# EasyEDA Pro project Project.epro

# Schematic Schematic1
Board Name: Board1; Create Date: 2026-02-10; Page Name: P1; Project Name: tp4056 charger; Schematic Name: Schematic1; Update Date: 2026-02-09; Company: EasyEDA.com; Page Size: A4; Version: V1.0
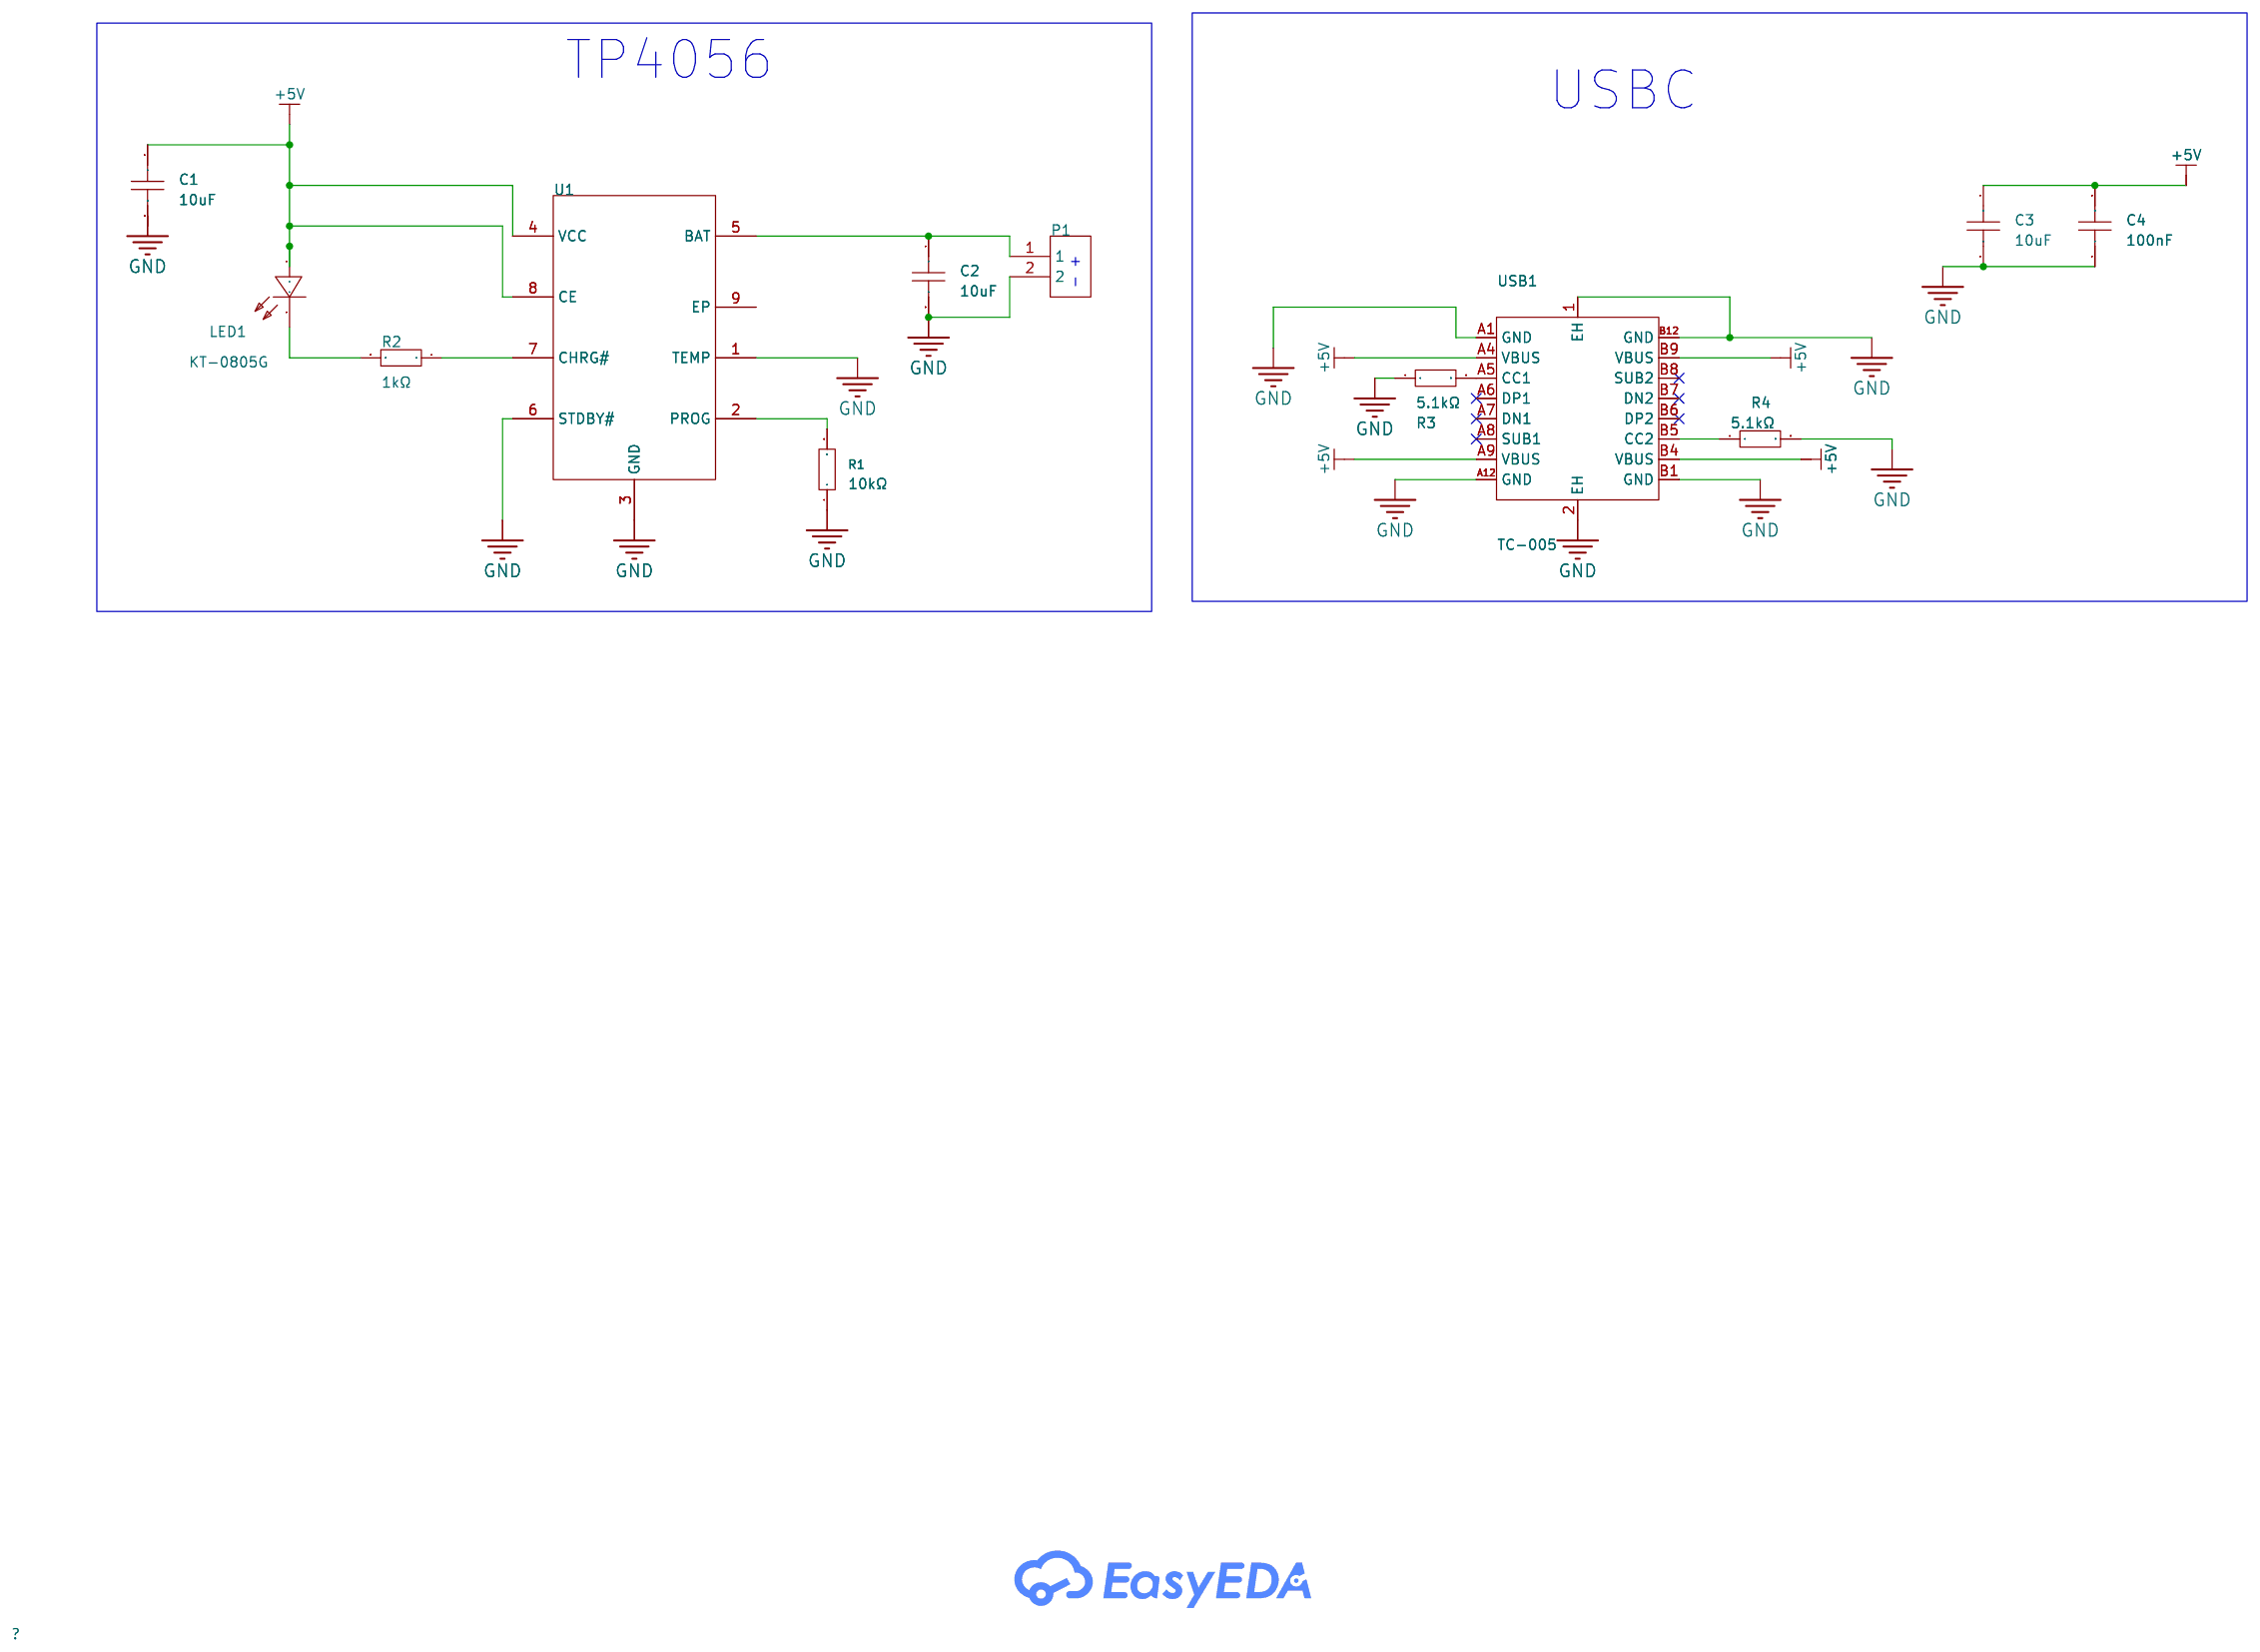
[diagram p0: schematic sheet]

## Parts
C1  10uF  [C0805]
C2  10uF  [C0805]
C3  10uF  [C0805]
C4  100nF  [C0402]
LED1  KT-0805G  [LED0805-R-RD]
P1  WJ301V-5.0-02P-12-00A  [CONN-TH_2P-P5.00_WJ301V-5.00-2P]
R1  10kΩ  [R1206]
R2  1kΩ  [R0402]
R3  5.1kΩ  [R0603]
R4  5.1kΩ  [R0603]
U1  TP4056-42-ESOP8  [ESOP-8_L4.9-W3.9-P1.27-LS6.0-BL-EP]
USB1  TC-005  [USB-C-SMD_TC-005]

## Library data of the parts
C1-C3 = CL21A106KAYNNNE_C15850: Capacitance:10uF Tolerance:±10% Tolerance:±10% Voltage Rating:25V Temperature Coefficient:X5R; LCSC Part Name: 10uF ±10% 25V; Supplier Part: C15850; Manufacturer: SAMSUNG(三星); Manufacturer Part: CL21A106KAYNNNE; Supplier Footprint: 0805; JLCPCB Part Class: Basic Part; Datasheet: https://item.szlcsc.com/datasheet/CL21A106KAYNNNE/16532.html; Supplier: LCSC; Tolerance: ±10%; Voltage Rating: 25V; Temperature Coefficient: X5R
C4 = CL05B104KO5NNNC: Capacitance:100nF Tolerance:±10% Tolerance:±10% Voltage Rating:16V Temperature Coefficient:X7R; LCSC Part Name: 100nF ±10% 16V; Supplier Part: C1525; Manufacturer: SAMSUNG(三星); Supplier Footprint: 0402; JLCPCB Part Class: Basic Part; Datasheet: https://item.szlcsc.com/datasheet/CL05B104KO5NNNC/1877.html; Supplier: LCSC; Tolerance: ±10%; Voltage Rating: 16V; Temperature Coefficient: X7R
LED1 = KT-0805G: Lamp Holder Type:- Illumination Color:Emerald Green Voltage - Forward(Vf):2.6V~3.1V Voltage - Forward(Vf):2.6V~3.1V Power(Watts):100mW Forward Current:5mA Wavelength - Dominant:513nm~528nm Wavelength - Dominant:513nm~528nm Peak Wavelength:525nm Diode Conf; LCSC Part Name: 0805 翠绿 高亮; Supplier Part: C2297; Manufacturer: KENTO; Supplier Footprint: 0805; JLCPCB Part Class: Basic Part; Datasheet: https://item.szlcsc.com/datasheet/KT-0805G/2670.html; Supplier: LCSC; Illumination Color: Emerald Green; Voltage - Forward(Vf): 2.6V~3.1V; Power(Watts): 100mW; Forward Current: 5mA; Wavelength - Dominant: 513nm~528nm; Peak Wavelength: 525nm; Luminous Intensity: 430mcd; Viewing Angle: 120°; Operating Temperature: -40℃~+85℃
P1 = WJ301V-5.0-02P-12-00A: Number of Positions or Pins:1x2P Pitch:5mm Color:Blue Mounting Type:Through Hole Number of Pins:2P Number of Rows:1 Number of PINs Per Row:2 Current Rating:17.5A Voltage Rating (Max):250V Wire Gauge - AWG:14~22 Wire Gauge - mm2:1.5 Wire Gauge - mm2:1.5 Op; LCSC Part Name: 5mm 1x2P 排数:1 每排P数:2 直插; Supplier Part: C8475; Manufacturer: KANGNEX(康奈克斯电气); Supplier Footprint: 插件,P=5mm; JLCPCB Part Class: Extended Part; Datasheet: https://item.szlcsc.com/datasheet/WJ301V-5.0-02P-12-00A/8969.html; Supplier: LCSC; Number of Positions or Pins: 1x2P; Pitch: 5mm; Color: Blue; Mounting Type: Through Hole; Number of Pins: 2P; Number of Rows: 1; Number of PINs Per Row: 2; Current Rating: 17.5A; Voltage Rating (Max): 250V; Wire Gauge - AWG: 14~22; Wire Gauge - mm2: 1.5; Operating Temperature: -30℃~+120℃
R1 = 1206W4F1002T5E: Type:Thick Film Resistor Resistance:10kΩ Tolerance:±1% Tolerance:±1% Power(Watts):250mW Voltage-Supply(Max):200V Temperature Coefficient:±100ppm/℃ Temperature Coefficient:±100ppm/℃ Operating Temperature:-55℃~+155℃ Operating Temperature:-55℃~+155℃; LCSC Part Name: 10kΩ ±1% 250mW 厚膜电阻; Supplier Part: C17902; Manufacturer: UNI-ROYAL(厚声); Supplier Footprint: 1206; JLCPCB Part Class: Basic Part; Datasheet: https://item.szlcsc.com/datasheet/1206W4F1002T5E/18590.html; Supplier: LCSC; Type: Thick Film Resistor; Tolerance: ±1%; Power(Watts): 250mW; Voltage-Supply(Max): 200V; Temperature Coefficient: ±100ppm/℃; Operating Temperature: -55℃~+155℃
R2 = 0402WGF1001TCE: Type:Thick Film Resistor Resistance:1kΩ Tolerance:±1% Tolerance:±1% Power(Watts):62.5mW Voltage-Supply(Max):50V Temperature Coefficient:±100ppm/℃ Temperature Coefficient:±100ppm/℃ Operating Temperature:-55℃~+155℃ Operating Temperature:-55℃~+155℃; LCSC Part Name: 1kΩ ±1% 62.5mW 厚膜电阻; Supplier Part: C11702; Manufacturer: UNI-ROYAL(厚声); Supplier Footprint: 0402; JLCPCB Part Class: Basic Part; Datasheet: https://item.szlcsc.com/datasheet/0402WGF1001TCE/12256.html; Supplier: LCSC; Type: Thick Film Resistor; Tolerance: ±1%; Power(Watts): 62.5mW; Voltage-Supply(Max): 50V; Temperature Coefficient: ±100ppm/℃; Operating Temperature: -55℃~+155℃
R3 R4 = 0603WAF5101T5E: Type:Thick Film Resistor Resistance:5.1kΩ Tolerance:±1% Tolerance:±1% Power(Watts):100mW Voltage-Supply(Max):75V Temperature Coefficient:±100ppm/℃ Temperature Coefficient:±100ppm/℃ Operating Temperature:-55℃~+155℃ Operating Temperature:-55℃~+155℃; LCSC Part Name: 5.1kΩ ±1% 100mW 厚膜电阻; Supplier Part: C23186; Manufacturer: UNI-ROYAL(厚声); Supplier Footprint: 0603; JLCPCB Part Class: Basic Part; Datasheet: https://item.szlcsc.com/datasheet/0603WAF5101T5E/23913.html; Supplier: LCSC; Type: Thick Film Resistor; Tolerance: ±1%; Power(Watts): 100mW; Voltage-Supply(Max): 75V; Temperature Coefficient: ±100ppm/℃; Operating Temperature: -55℃~+155℃
U1 = TP4056-42-ESOP8: The Chip Type:Charging IC Voltage - Supply:4V~8V Voltage - Supply:4V~8V Charge Current - Max:1A Charging Saturation Voltage:4.2V End-Off Voltage:- Type of Battery:Lithium Battery Number of Cells:1 Number of Cells:1 Operating Temperature:-40℃~+85℃ Operatin; LCSC Part Name: 1A线性锂离子电池充电器; Supplier Part: C16581; Manufacturer: TOPPOWER(南京拓微); Supplier Footprint: ESOP-8; JLCPCB Part Class: Extended Part; Datasheet: https://item.szlcsc.com/datasheet/TP4056-42-ESOP8/17264.html; Supplier: LCSC; The Chip Type: Charging IC; Voltage - Supply: 4V~8V; Charge Current - Max: 1A; Charging Saturation Voltage: 4.2V; Type of Battery: Lithium Battery; Number of Cells: 1; Operating Temperature: -40℃~+85℃; Battery Temperature Detection: Support; Supply Current (Iq): 2uA
USB1 = TC-005_C6332285: Connector Type:Type-C Protocol Standard:- Gender:Male Mounting Type:Surface Mount,Vertical Number of Contacts:16P Number of Ports:1 Current Rating-Power:3A Voltage Rating:- Connect-Disconnect Life:1万次 Supplementary Features:- Center Height:- Length:8.5mm; LCSC Part Name: Type-C 公 立贴; Supplier Part: C6332285; Manufacturer: HANBO(汉博); Supplier Footprint: SMD; JLCPCB Part Class: Extended Part; Datasheet: https://item.szlcsc.com/datasheet/TC-005/7280525.html; Supplier: LCSC; Connector Type: Type-C; Gender: Male; Mounting Type: Surface Mount,Vertical; Number of Contacts: 16P; Number of Ports: 1; Current Rating-Power: 3A; Connect-Disconnect Life: 1万次; Length: 8.5mm; Detection color: Black; Operating Temperature: -25℃~+85℃

## Nets
+5V: C1.1 C3.1 C4.2 LED1.1(A) U1.4(VCC) U1.8(CE) USB1.A4(VBUS) USB1.A9(VBUS) USB1.B4(VBUS) USB1.B9(VBUS)
GND: C1.2 C2.2 C3.2 C4.1 P1.2 R1.1 R3.1 R4.2 U1.1(TEMP) U1.3(GND) U1.6(STDBY#) USB1.1(EH) USB1.2(EH) USB1.A1(GND) USB1.A12(GND) USB1.B1(GND) USB1.B12(GND)
$1N543: R1.2 U1.2(PROG)
$1N770: LED1.2(K) R2.2
$1N1102: C2.1 P1.1 U1.5(BAT)
$1N1172: R2.1 U1.7(CHRG#)
$1N1585: R3.2 USB1.A5(CC1)
$1N1795: R4.1 USB1.B5(CC2)

Not connected (* = marked no-connect by the designer): U1 9(EP); USB1 A6(DP1)* A7(DN1)* A8(SUB1)* B6(DP2)* B7(DN2)* B8(SUB2)*

## Notes on the sheet
- TP4056
- USBC
- - +

# Board PCB1
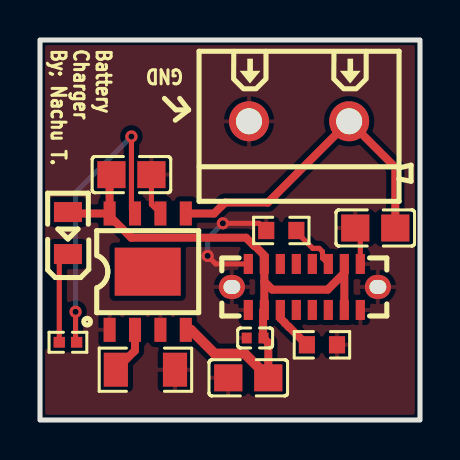
[diagram p1: board, top side]
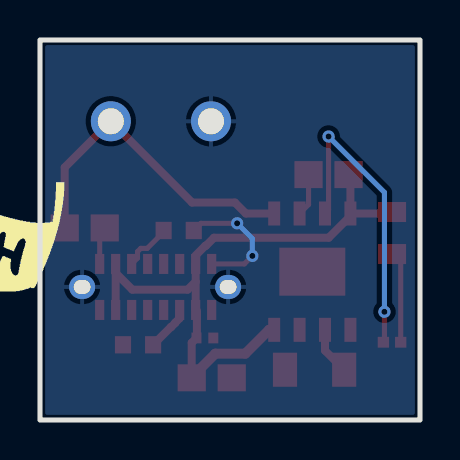
[diagram p2: board, bottom side, seen from below]

Outline 19 x 19 mm; copper layers: Top Layer, Bottom Layer. Coordinates in mm from the lower left corner of the outline.
Outline path: rectangle 0,19 19,0
Stack: Top Layer 0.035mm / Dielectric1 1.51mm FR4 er 4.5 / Bottom Layer 0.035mm

## Design rules (mm)
template: JLCPCB Capability(Two Layers Board)
spacing copperThickness1oz (default): track to track 0.102, other pairs 0.152 to 0.3
spacing copperThickness2oz: track to track 0.203, other pairs 0.152 to 0.3
track width copperThickness1oz (default): min 0.127, default 0.254, max 2.54
track width copperThickness2oz: min 0.203, default 0.254, max 2.54
differential pair differentialPair (default): width min 0.127, default 0.254, max 2.54; gap min 0.152, default 0.152
via viaSize (default): diameter min 0.5, default 0.61, max 10; hole min 0.3, default 0.305, max 6.3

## Placement (name value [footprint] x y rotation side)
C1  10uF  [C0805]  4.57 12.27 0 top
C2  10uF  [C0805]  16.76 9.6 180 top
C3  10uF  [C0805]  10.41 2.11 180 top
C4  100nF  [C0402]  10.76 4.1 0 top
LED1  KT-0805G  [LED0805-R-RD]  1.4 9.35 90 top
P1  WJ301V-5.0-02P-12-00A  [CONN-TH_2P-P5.00_WJ301V-5.00-2P]  12.95 14.94 180 top
R1  10kΩ  [R1206]  5.27 2.51 180 top
R2  1kΩ  [R0402]  1.4 3.89 180 top
R3  5.1kΩ  [R0603]  14.1 3.76 180 top
R4  5.1kΩ  [R0603]  12.07 9.47 180 top
U1  TP4056-42-ESOP8  [ESOP-8_L4.9-W3.9-P1.27-LS6.0-BL-EP]  5.39 7.42 0 top
USB1  TC-005  [USB-C-SMD_TC-005]  13.24 6.65 0 top

## Footprints (pads in the part's own frame, mm; a bottom-side part is the same pattern mirrored in y, then rotated)
C0402
  rect 0.5x0.54 smd: 1(-0.42,0) 2(0.42,0)
C0805
  rect 1.41x1.35 smd: 1(-1,0) 2(1,0)
CONN-TH_2P-P5.00_WJ301V-5.00-2P
  round 2 hole 1.3: 1(-2.505,0) 2(2.505,0)
ESOP-8_L4.9-W3.9-P1.27-LS6.0-BL-EP
  rect 0.6x1.2 smd: 1(-1.905,-2.909) 2(-0.635,-2.909) 3(0.635,-2.909) 4(1.905,-2.909) 5(1.905,2.909) 6(0.635,2.909) 7(-0.635,2.909) 8(-1.905,2.909)
  rect 3.3x2.4 smd: 9(0,0)
LED0805-R-RD
  rect 1x1.399 smd: 1(1.05,0) 2(-1.05,0)
R0402
  rect 0.566x0.54 smd: 1(-0.433,0) 2(0.433,0)
R0603
  rect 0.806x0.864 smd: 1(-0.753,0) 2(0.753,0)
R1206
  rect 1.208x1.701 smd: 1(-1.479,0) 2(1.479,0)
USB-C-SMD_TC-005
  oval 1.3x1.2 hole 0.84x0.7: 1(-3.65,0) 2(3.65,0)
  rect 0.46x1 smd: A1(-2.827,-1.15) A4(-2.027,-1.15) A5(-1.227,-1.15) A6(-0.427,-1.15) A7(0.373,-1.15) A8(1.173,-1.15) A9(1.973,-1.15) A12(2.773,-1.15) B1(2.773,1.15) B4(1.973,1.15) B5(1.173,1.15) B6(0.373,1.15) B7(-0.427,1.15) B8(-1.227,1.15) B9(-2.027,1.15) B12(-2.827,1.15)

## Nets
As in the schematic.

Pads without a net: U1 9; USB1 A6 A7 A8 B6 B7 B8

## Via types
v1: diameter 0.61, hole 0.305, Top Layer to Bottom Layer, 4 vias

## Routing (per net, layer and track width the routed paths; a pad name or vN(x,y) marks a point on that pad's centre or on a via; arc(x,y) is an arc through that point)
+5V: length 30.5
  Top Layer w0.4: USB1.B4 15.22,7.35 ; 15.22,7.35 USB1.A9 ; 15.22,7.35 14.38,6.52 11.62,6.52 11.22,6.92 ; U1.8 3.42,10.26 4.56,9.11 10.3,9.11 10.7,8.71 10.73,8.71 11.22,8.23 ; U1.8 3.48,12.18 C1.1 ; U1.8 1.47,10.32 LED1.1 ; 11.22,6.92 USB1.B9 ; 11.22,6.92 USB1.A4 ; 11.15,5.46 11.15,4.12 C4.2 11.41,3.86 C3.1
  Top Layer w0.5: C3.1 11.41,2.14 10.23,3.32 8.74,3.32 7.54,4.51 U1.4
GND: length 10.5
  Top Layer w0.254: USB1.B1 16.02,9.35 C2.2 ; USB1.B12 8.78,7.8 v1(8.38,8.2) ; v1(9.14,9.83) 10.95,9.83 R4.2 ; C1.2 5.57,10.77 U1.6
  Bottom Layer w0.254: v1(9.14,9.83) 8.38,9.07 v1(8.38,8.2)
$1N543: length 2.4
  Top Layer w0.4: 3.79,2.51 4.75,3.47 U1.2
$1N770: length 4.6
  Top Layer w0.254: R2.2 0.96,7.86 LED1.2
$1N1102: length 16.4
  Top Layer w0.4: C2.1 17.76,12.63 P1.1 11.39,10.87 9.25,10.87 8.71,10.32 U1.5
$1N1172: length 15.4
  Top Layer w0.254: v1(1.78,5.41) 1.78,3.94 R2.1 ; U1.7 4.57,10.5 v1(4.57,14.17)
  Bottom Layer w0.254: v1(1.78,5.41) 1.78,11.38 v1(4.57,14.17)
$1N1585: length 2.3
  Top Layer w0.4: R3.2 12.45,4.65 12.44,4.65 12.23,4.86 12.23,4.87 12.02,5.09 USB1.A5
$1N1795: length 2.5
  Top Layer w0.254: USB1.B5 14.12,8.09 14.12,8.42 13.96,8.58 13.64,8.58 12.82,9.4 R4.1

## Copper pours and planes (outline as drawn; the poured copper is in the pictures)
GND on Top Layer: -1.4,21.03 24.13,21.03 24.13,-2.72 -1.4,-2.72
GND on Bottom Layer: -2.92,21.67 25.91,21.67 25.91,-4.24 -2.92,-4.24

## Text on the board
Top Silkscreen Layer: GND | Battery / Charger / By; Nachu T.
